# Altium project PCB_Project_Source_IoT.PrjPcb (part 2 of 3)

## Sheet Sheet4_Carregador_Bateria.SchDoc
size A4; SheetNumber: 4; SheetTotal: 6
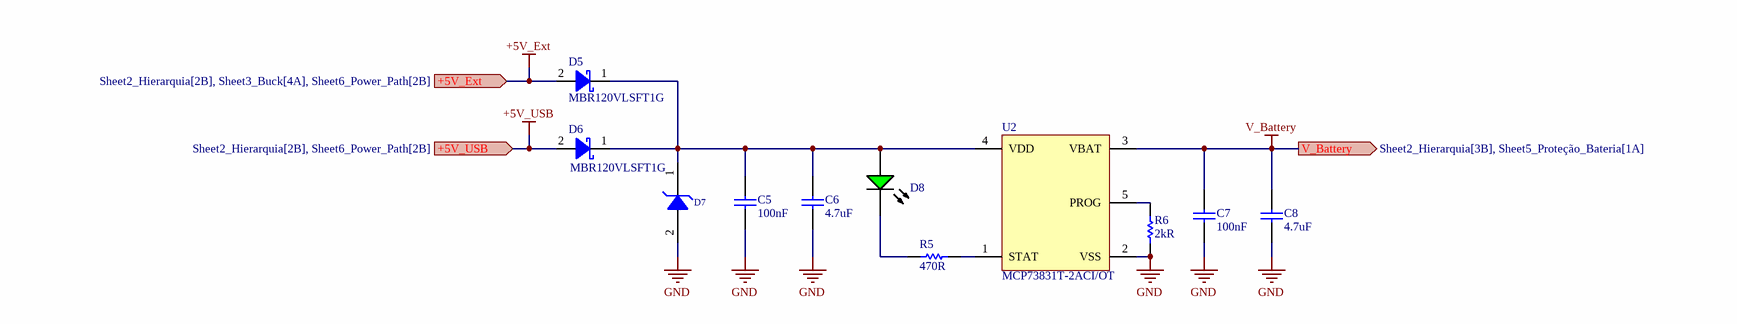
[diagram p3: Sheet4_Carregador_Bateria.SchDoc]

### Parts
(Parts that share a designator on the sheet are numbered #1, #2 ... from top to bottom, then left to right.)
?#2  (no value)  (graphical)
C5  value 100nF  [C-0805]  (hidden comment: CL21B104KACNNNC)
C6  value 4.7uF  [C-0805]  (hidden comment: C2012X5R1E475K125AB)
C7  value 100nF  [C-0805]  (hidden comment: CL21B104KACNNNC)
C8  value 4.7uF  [C-0805]  (hidden comment: C2012X5R1E475K125AB)
D5  MBR120VLSFT1G  [SOD-123F]
D6  MBR120VLSFT1G  [SOD-123F]
D7  SMAJ5.0A-13-F  [DO-214AC]  (value not drawn)
D8  LTST-C170GKT  [0805-LED-G]  (value not drawn)
R5  value 470R  [R-0805]  (hidden comment: CRGCQ0805J470R)
R6  value 2kR  [R-0805]  (hidden comment: ERJ-6ENF2001V)
U2  MCP73831T-2ACI/OT  [TSOT-23-5_A]

### Ports
+5V_Ext (in, see Sheet2_Hierarquia[2B], Sheet3_Buck[4A], Sheet6_Power_Path[2B]), +5V_USB (in, see Sheet2_Hierarquia[2B], Sheet6_Power_Path[2B]), V_Battery (out, see Sheet2_Hierarquia[3B], Sheet5_Proteção_Bateria[1A])

### Nets
+5V_Ext: D5.2(A) ; port +5V_Ext
+5V_USB: D6.2(A) ; port +5V_USB
GND: C5.2 C6.2 C7.2 C8.2 D7.2(A) R6.1 U2.2(VSS)
V_Battery: C7.1 C8.1 U2.3(VBAT) ; port V_Battery
NetC5_1: C5.1 C6.1 D5.1(K) D6.1(K) D7.1(K) D8.2(A) U2.4(VDD)
NetD8_1: D8.1(K) R5.1
NetR5_2: R5.2 U2.1(STAT)
NetR6_2: R6.2 U2.5(PROG)

### Notes on the sheet
- Título:
- Endereço
- Rua Aprígio Veloso, 1500 - Bodocongó
  CEP: 58.429-140
  Campina Grande - Paraíba
  Brasil
- Projeto:
- Conta:
- Projetista:
- Arquivo:
- Data:
- Revisor:
- Rev.:
- Pág.:
- de

### Library data of the parts
?#2 = Title Block
C5 C7 = CL21B104KACNNNC: CAP CER 0.1UF 25V X7R 0805; Manufacturer: Samsung; Material: Ceramic; Tolerance: 10%; Supplier: Digikey; Supplier Part Number: 1276-1099-6-ND; Manufacturer Part Number: CL21B104KACNNNC; RoHS: Yes; Category: Ceramic Capacitors; Stock: 257719; Pricing: 1=0,1, 10=0,031, 50=0,0208, 100=0,0178, 500=0,01262, 1000=0,01102 (USD); Mounting Technology: Surface Mount; Case/Package: 0805; Case Code (Metric): 2012; Case Code (Imperial): 0805; Min Operating Temperature: -55°C; Max Operating Temperature: 125°C; Package Quantity: 1; Packaging: Tape and Reel; Voltage Rating: 25V; Dielectric: X7R; Voltage: 25V; Series: CL; Construction: Flat; Length: 2mm; Width: 0.049inch; Height: 0.85mm; Thickness: 0.037inch; Depth: 1.25mm; Radiation Hardening: No; RoHS Compliant: Yes; ComponentLink1URL: https://datasheet.ciiva.com/25801/cl21b104kacnnnc-25801824.pdf?src-supplier=Digikey; ComponentLink1Description: https://datasheet.ciiva.com/25801/cl21b104kacnnnc-25801824.pdf?src-supplier=Digikey; ComponentLink2URL: https://datasheet.ciiva.com/15216/getdatasheetpartid-355204-15216236.pdf?src-supplier=Verical; ComponentLink2Description: https://datasheet.ciiva.com/15216/getdatasheetpartid-355204-15216236.pdf?src-supplier=Verical; Supplier 1: Digikey; Supplier Part Number 1: 1276-1099-1-ND; Supplier 2: Mouser; Supplier Part Number 2: 187-CL21B104KACNNNC; Voltage Rating (DC): 25V
C6 C8 = C2012X5R1E475K125AB: CAP CER 4.7UF 25V X5R 0805; Manufacturer: TDK; Dielectric Material: Ceramic; Tolerance: 10%; Supplier: Digikey; Supplier Part Number: 445-4116-1-ND; Manufacturer Part Number: C2012X5R1E475K125AB; RoHS: Yes; Category: Ceramic Capacitors; Stock: 2075676; Pricing: 1=0,27, 10=0,158, 50=0,1126, 100=0,0984, 500=0,07452, 1000=0,06706 (USD); Mounting Technology: Surface Mount; Case/Package: 0805; Pins: 2; Case Code (Imperial): 0805; Case Code (Metric): 2012; Weight: 0.000194oz; Material: Ceramic; Min Operating Temperature: -55°C; Max Operating Temperature: 85°C; Voltage Rating: 25V; Voltage Rating (DC): 25V; Packaging: Tape and Reel; Package Quantity: 2000; Dielectric: X5R; Termination: SMD/SMT; Voltage: 25V; Series: C; Construction: Flat; Length: 2mm; Width: 1.25mm; Height: 1.25mm; Depth: 1.25mm; Reach SVHC Compliant: No; Lead Free: Lead Free; RoHS Compliant: Yes; ComponentLink1URL: https://datasheet.ciiva.com/24216/tdkmlcccaprange-24216480.pdf?src-supplier=Mouser; ComponentLink1Description: https://datasheet.ciiva.com/24216/tdkmlcccaprange-24216480.pdf?src-supplier=Mouser; ComponentLink2URL: https://datasheet.ciiva.com/11788/0900766b80c1bb00-11788107.pdf?src-supplier=Rs; ComponentLink2Description: https://datasheet.ciiva.com/11788/0900766b80c1bb00-11788107.pdf?src-supplier=Rs; ComponentLink3URL: https://datasheet.ciiva.com/6251/tdkmlcccaprange-6251817.pdf?src-supplier=Digikey; ComponentLink3Description: https://datasheet.ciiva.com/6251/tdkmlcccaprange-6251817.pdf?src-supplier=Digikey; ComponentLink4URL: https://datasheet.ciiva.com/6251/tdkmlcccaprange-6251820.pdf?src-supplier=Digikey; ComponentLink4Description: https://datasheet.ciiva.com/6251/tdkmlcccaprange-6251820.pdf?src-supplier=Digikey; ComponentLink5URL: https://datasheet.ciiva.com/6251/tdkmlcccaprange-6251823.pdf?src-supplier=Digikey; ComponentLink5Description: https://datasheet.ciiva.com/6251/tdkmlcccaprange-6251823.pdf?src-supplier=Digikey; ComponentLink6URL: https://datasheet.ciiva.com/28602/1744655-28602173.pdf?src-supplier=Element14; ComponentLink6Description: https://datasheet.ciiva.com/28602/1744655-28602173.pdf?src-supplier=Element14; ComponentLink7URL: https://datasheet.ciiva.com/36857/1796654-36857301.pdf?src-supplier=Element14; ComponentLink7Description: https://datasheet.ciiva.com/36857/1796654-36857301.pdf?src-supplier=Element14; ComponentLink8URL: https://datasheet.ciiva.com/16449/e412-c-16449599.pdf?src-supplier=Future+Electronics; ComponentLink8Description: https://datasheet.ciiva.com/16449/e412-c-16449599.pdf?src-supplier=Future+Electronics; Supplier 1: Mouser; Supplier Part Number 1: 810-C2012X5R1E475K; Supplier 2: Digikey; Supplier Part Number 2: 445-4116-1-ND
D5 D6 = MBR120VLSFT1G: DIODE SCHOTTKY 20V 1A SOD123FL; Manufacturer: ON Semiconductor; Max Surge Current: 45A; Forward Voltage: 340mV; Max Reverse Current: 600uA; Element Configuration: Single; Polarity: Standard; Supplier: Digikey; Supplier Part Number: MBR120VLSFT1GOSCT-ND; Manufacturer Part Number: MBR120VLSFT1G; RoHS: Yes; Category: Schottky Diodes; Stock: 20847; Pricing: 1=0,56, 10=0,348, 100=0,2217, 500=0,16708, 1000=0,14944 (USD); Pins: 2; Min Operating Temperature: -65°C; Max Operating Temperature: 125°C; Package Quantity: 3000; Forward Current: 1A; Packaging: Tape and Reel; Max Reverse Leakage Current: 600uA; Average Rectified Current: 1A; Max Repetitive Reverse Voltage (Vrrm): 20V; Max Forward Surge Current (Ifsm): 45A; Peak Non-Repetitive Surge Current: 45A; Voltage Rating (DC): 20V; Current Rating: 1A; Output Current: 1A; Max Reverse Voltage (DC): 20V; Series: -; Length: 0.114inch; Width: 0.071inch; Height: 0.035inch; Radiation Hardening: No; Reach SVHC Compliant: No; Lead Free: Lead Free; Halogen Free: Halogen Free; RoHS Compliant: Yes; ComponentLink1URL: https://datasheet.ciiva.com/7962/85900-7962720.pdf?src-supplier=Element14; ComponentLink1Description: https://datasheet.ciiva.com/7962/85900-7962720.pdf?src-supplier=Element14; ComponentLink2URL: https://datasheet.ciiva.com/915/mbr120vlsft1-d-915659.pdf?src-supplier=Digikey; ComponentLink2Description: https://datasheet.ciiva.com/915/mbr120vlsft1-d-915659.pdf?src-supplier=Digikey; ComponentLink3URL: https://datasheet.ciiva.com/915/mbr120vlsft1-d-915660.pdf?src-supplier=Digikey; ComponentLink3Description: https://datasheet.ciiva.com/915/mbr120vlsft1-d-915660.pdf?src-supplier=Digikey; ComponentLink4URL: https://datasheet.ciiva.com/18435/70100467-18435526.pdf?src-supplier=Allied+Electronics; ComponentLink4Description: https://datasheet.ciiva.com/18435/70100467-18435526.pdf?src-supplier=Allied+Electronics; ComponentLink5URL: https://datasheet.ciiva.com/16392/mbr120vlsft1-d-16392906.pdf?src-supplier=Future+Electronics; ComponentLink5Description: https://datasheet.ciiva.com/16392/mbr120vlsft1-d-16392906.pdf?src-supplier=Future+Electronics; Supplier 1: Digikey; Supplier Part Number 1: MBR120VLSFT1GOSCT-ND; Supplier 2: Mouser; Supplier Part Number 2: 863-MBR120VLSFT1G
D7 = SMAJ5.0A-13-F: TVS DIODE 5VWM 9.2VC SMA; Manufacturer: Diodes; Working Voltage: 5V; Clamping Voltage: 9.2V; Peak Pulse Power: 400W; Breakdown Voltage: 6.4V; Peak Pulse Current: 43.5A; Number of Elements: 1; Max Surge Current: 40A; Polarity: Unidirectional; Test Current: 10mA; Leakage Current: 800uA; Power Line Protection: No; Diode Type: ZENER; Max Breakdown Voltage: 7.25V; Element Configuration: Single; Capacitance: 2nF; Forward Voltage: 3.5V; Manufacturer Part Number: SMAJ5.0A-13-F; RoHS: Yes; Category: TVS Diodes; Stock 1: 435542; Pricing 1: 1=0,42000, 10=0,31700, 100=0,19770, 500=0,13528, 1000=0,10406, 2000=0,09366 (USD); Mount: Surface Mount; Case/Package: SMA; Number of Pins: 2; Contact Plating: Tin,Matte; Min Operating Temperature: -55°C; Max Operating Temperature: 150°C; Package Quantity: 5000; Termination: SMD/SMT; Series: -; Packaging: Tape and Reel; Reverse Standoff Voltage: 5V; Max Power Dissipation: 400W; Reverse Breakdown Voltage: 6.4V; Voltage Rating (DC): 5V; Min Breakdown Voltage: 6.4V; Resistor Type: Zener; Number of Unidirectional Channels: 1; Direction: Unidirectional; Max Reverse Leakage Current: 800uA; Power Dissipation: 400W; Clamping Voltage-Max: 9.2V; Max Output Current: 43.5A; ESD Protection: No; Length: 4.6mm; Width: 2.92mm; Height: 2.1mm; Radiation Hardening: No; RoHS Compliant: Yes; Lead Free: Lead Free; REACH SVHC: No SVHC; ComponentLink1URL: https://datasheet.ciiva.com/27052/1542127-27052431.pdf?src-supplier=Jameco; ComponentLink1Description: https://datasheet.ciiva.com/27052/1542127-27052431.pdf?src-supplier=Jameco; ComponentLink2URL: https://datasheet.ciiva.com/22696/1670961-22696859.pdf?src-supplier=Element14; ComponentLink2Description: https://datasheet.ciiva.com/22696/1670961-22696859.pdf?src-supplier=Element14; ComponentLink3URL: https://datasheet.ciiva.com/26933/getdatasheetpartid-35116-26933158.pdf?src-supplier=Verical; ComponentLink3Description: https://datasheet.ciiva.com/26933/getdatasheetpartid-35116-26933158.pdf?src-supplier=Verical; Supplier 1: Digi-Key; Supplier 2: Mouser; Supplier 3: Arrow Electronics; Supplier 4: Digi-Key; Supplier 5: Mouser; Supplier 6: Digi-Key; Supplier 7: Mouser; Supplier Part Number 7: 863-SZ1SMA5.0AT3G; Supplier Part Number 6: F11528CT-ND; Supplier Part Number 5: 625-SMAJ5.0A-E3; Supplier Part Number 4: SMAJ5.0A-E3/61GICT-ND; Supplier Part Number 3: SMAJ5.0A-13-F; Supplier Part Number 2: 621-SMAJ5.0A-13-F; Supplier Part Number 1: SMAJ5.0A-FDICT-ND; JLCPCB Part: C87074
D8 = LTST-C170GKT: LED GREEN CLEAR SMD; Manufacturer: Vishay Lite-On; Lens Color: Colorless; Luminous Intensity: 6mcd; Forward Voltage: 2.1V; Test Current: 10mA; Wavelength: 565nm; Viewing Angle: 130°; Dominant Wavelength: 569nm; Lens Style: Diffused,Colorless,Rectangular; Forward Current: 30mA; Number of LEDs: 1; Power Dissipation: 100mW; Reverse Voltage: 5V; Supplier 1: Digi-Key; Manufacturer Part Number: LTST-C170GKT; RoHS: Yes; Category: LEDs; Stock 1: 753504; Pricing 1: 1=0,30000, 10=0,16000, 100=0,07440, 500=0,06870, 1000=0,05382 (USD); Mount: Surface Mount; Case/Package: 0805; Number of Pins: 2; Color: Green; Case Code (Metric): 2012; Case Code (Imperial): 0805; Min Operating Temperature: -55°C; Max Operating Temperature: 85°C; Package Quantity: 1; Packaging: Tape and Reel; Series: CHIPLED 0805; Lens Transparency: Clear; Illumination Color: Green; Number of Elements: 1; Power Rating: 100mW; Voltage: 5V; Length: 2mm; Width: 1.25mm; Height: 1.1mm; Depth: 1.25mm; Radiation Hardening: No; RoHS Compliant: Yes; Lead Free: Lead Free; ComponentLink1URL: https://datasheet.ciiva.com/2110/ltst-c170gkt-2110128.pdf?src-supplier=Digi-Key; ComponentLink1Description: https://datasheet.ciiva.com/2110/ltst-c170gkt-2110128.pdf?src-supplier=Digi-Key; ComponentLink2URL: https://datasheet.ciiva.com/11773/0900766b80dc0278-11773630.pdf?src-supplier=RSComponents; ComponentLink2Description: https://datasheet.ciiva.com/11773/0900766b80dc0278-11773630.pdf?src-supplier=RSComponents; ComponentLink3URL: https://datasheet.ciiva.com/12400/lite-on-ltst-c170gkt-187191-12400783.pdf?src-supplier=Mouser; ComponentLink3Description: https://datasheet.ciiva.com/12400/lite-on-ltst-c170gkt-187191-12400783.pdf?src-supplier=Mouser; ComponentLink4URL: https://datasheet.ciiva.com/15117/getdatasheetpartid-142079-15117738.pdf?src-supplier=Verical; ComponentLink4Description: https://datasheet.ciiva.com/15117/getdatasheetpartid-142079-15117738.pdf?src-supplier=Verical; ComponentLink5URL: https://datasheet.ciiva.com/25772/ltst-c170gkt-25772881.pdf?src-supplier=Allied+Electronics; ComponentLink5Description: https://datasheet.ciiva.com/25772/ltst-c170gkt-25772881.pdf?src-supplier=Allied+Electronics; ComponentLink6URL: https://datasheet.ciiva.com/16387/ltst-c170gkt-16387357.pdf?src-supplier=Future+Electronics; ComponentLink6Description: https://datasheet.ciiva.com/16387/ltst-c170gkt-16387357.pdf?src-supplier=Future+Electronics; Supplier 2: Mouser; Supplier Part Number 2: 859-LTST-C170GKT; Supplier Part Number 1: 160-1179-1-ND; JLCPCB Part: C125090
R5 = CRGCQ0805J470R: RES 470 OHM 5% 1/8W 0805; Manufacturer: TE Connectivity; Max Power Dissipation: 125mW; Temperature Coefficient: 100ppm/°C; Operating Supply Voltage: 150V; Supplier: Digikey; Supplier Part Number: A130132CT-ND; Manufacturer Part Number: CRGCQ0805J470R; RoHS: Yes; Category: Chip SMD Resistors; Stock: 837845; Pricing: 1=0,1, 10=0,026, 50=0,0162, 100=0,0137, 500=0,00942, 1000=0,00813 (USD); Case/Package: 0805; Case Code (Imperial): 0805; Case Code (Metric): 2012; Min Operating Temperature: -55°C; Max Operating Temperature: 155°C; Features: Moisture Resistant,Automotive AEC-Q200; Series: CRGCQ; Packaging: Cut Tape; Tolerance: 5%; Number of Terminations: 2; Power Rating: 125mW; Voltage Rating: 150V; Voltage Rating (DC): 150V; Height: 650um; Ratings: AEC-Q200; RoHS Compliant: Yes; ComponentLink1URL: http://datasheet.octopart.com/CRGCQ0805J470R-TE-Connectivity-datasheet-114679081.pdf?src-supplier=Digikey; ComponentLink1Description: http://datasheet.octopart.com/CRGCQ0805J470R-TE-Connectivity-datasheet-114679081.pdf?src-supplier=Digikey; ComponentLink2URL: http://datasheet.octopart.com/CRGCQ0805J470R-TE-Connectivity-datasheet-114679081.pdf?src-supplier=Farnell; ComponentLink2Description: http://datasheet.octopart.com/CRGCQ0805J470R-TE-Connectivity-datasheet-114679081.pdf?src-supplier=Farnell; ComponentLink3URL: http://datasheet.octopart.com/CRGCQ0805J470R-TE-Connectivity-datasheet-114679081.pdf?src-supplier=Avnet; ComponentLink3Description: http://datasheet.octopart.com/CRGCQ0805J470R-TE-Connectivity-datasheet-114679081.pdf?src-supplier=Avnet; ComponentLink4URL: http://datasheet.octopart.com/CRGCQ0805J470R-TE-Connectivity-datasheet-114679081.pdf?src-supplier=Mouser; ComponentLink4Description: http://datasheet.octopart.com/CRGCQ0805J470R-TE-Connectivity-datasheet-114679081.pdf?src-supplier=Mouser; ComponentLink5URL: http://datasheet.octopart.com/CRGCQ0805J470R-TE-Connectivity-datasheet-114679081.pdf?src-supplier=Newark; ComponentLink5Description: http://datasheet.octopart.com/CRGCQ0805J470R-TE-Connectivity-datasheet-114679081.pdf?src-supplier=Newark; ComponentLink6URL: http://datasheet.octopart.com/CRGCQ0805J470R-TE-Connectivity-datasheet-114679081.pdf?src-supplier=Onlinecomponents.com; ComponentLink6Description: http://datasheet.octopart.com/CRGCQ0805J470R-TE-Connectivity-datasheet-114679081.pdf?src-supplier=Onlinecomponents.com; ComponentLink7URL: https://datasheet.octopart.com/CRGCQ0805J470R-TE-Connectivity-datasheet-114679081.pdf?src-supplier=Master+Electronics; ComponentLink7Description: https://datasheet.octopart.com/CRGCQ0805J470R-TE-Connectivity-datasheet-114679081.pdf?src-supplier=Master+Electronics; ComponentLink8URL: http://datasheet.octopart.com/CRGCQ0805J470R-TE-Connectivity-datasheet-114679081.pdf?src-supplier=Heilind+Electronics; ComponentLink8Description: http://datasheet.octopart.com/CRGCQ0805J470R-TE-Connectivity-datasheet-114679081.pdf?src-supplier=Heilind+Electronics; ComponentLink9URL: http://datasheet.octopart.com/CRGCQ0805J470R-TE-Connectivity-datasheet-114679081.pdf?src-supplier=Sager+Electronics; ComponentLink9Description: http://datasheet.octopart.com/CRGCQ0805J470R-TE-Connectivity-datasheet-114679081.pdf?src-supplier=Sager+Electronics; ComponentLink10URL: http://datasheet.octopart.com/CRGCQ0805J470R-TE-Connectivity-datasheet-114679081.pdf?src-supplier=Interstate+Connecting+Components; ComponentLink10Description: http://datasheet.octopart.com/CRGCQ0805J470R-TE-Connectivity-datasheet-114679081.pdf?src-supplier=Interstate+Connecting+Components; ComponentLink11URL: http://datasheet.octopart.com/CRGCQ0805J470R-TE-Connectivity-datasheet-114679081.pdf?src-supplier=Electro+Sonic; ComponentLink11Description: http://datasheet.octopart.com/CRGCQ0805J470R-TE-Connectivity-datasheet-114679081.pdf?src-supplier=Electro+Sonic; Supplier 1: Mouser; Supplier Part Number 1: 279-CRGCQ0805J470R; Supplier 2: Digikey; Supplier Part Number 2: A130132CT-ND
R6 = ERJ-6ENF2001V: RES SMD 2K OHM 1% 1/8W 0805; Manufacturer: Panasonic; Power Rating: 125mW; Voltage Rating: 150V; Temperature Coefficient: 100ppm/°C; Supplier: Digikey; Supplier Part Number: P2.00KCCT-ND; Manufacturer Part Number: ERJ-6ENF2001V; RoHS: Yes; Category: Chip SMD Resistors; Stock: 369929; Pricing: 1=0,11, 10=0,053, 50=0,0344, 100=0,0292, 500=0,02058, 1000=0,01792 (USD); Mounting Technology: Surface Mount; Case/Package: 0805; Case Code (Metric): 2012; Case Code (Imperial): 0805; Contact Plating: Tin; Weight: 0.000194oz; Min Operating Temperature: -55°C; Max Operating Temperature: 155°C; Packaging: Tape and Reel; Tolerance: 1%; Package Quantity: 1; Resistor Type: Thick Film; Number of Terminations: 2; Termination: SMD/SMT; Max Power Dissipation: 125mW; Voltage Rating (DC): 150V; Features: Automotive AEC-Q200; Series: ERJ; Resistance Tolerance: 1%; Construction: Rectangular; Technology: THICK FILM; Length: 2mm; Width: 1.2mm; Height: 0.6mm; Depth: 1.25mm; Radiation Hardening: No; Reach SVHC Compliant: No; Military Standard: Not; Lead Free: Lead Free; RoHS Compliant: Yes; Supplier 1: Mouser; Supplier Part Number 1: 667-ERJ-6ENF2001V; Supplier 2: Digikey; Supplier Part Number 2: P2.00KCCT-ND; Supplier 3: Digikey; Supplier Part Number 3: P2.00KCCT-ND
U2 = MCP73831T-2ACI/OT: IC BATT CNTL LI-ION 1CEL SOT23-5; Manufacturer: Microchip; Number of Cells: 1; Max Supply Voltage: 6V; Output Voltage: 4.2V; Min Supply Voltage: 3.75V; Output Current: 500mA; Max Output Voltage: 4.5V; Max Power Dissipation: 1.54W; Drain to Source Resistance: 350mR; Min Output Voltage: 4.168V; Voltage Rating: 4.534V; Fault Protection: Over Voltage; Supplier: Digikey; Supplier Part Number: MCP73831T-2ACI/OTCT-ND; Manufacturer Part Number: MCP73831T-2ACI/OT; RoHS: Yes; Category: Battery Management; Stock: 95605; Pricing: 1=0,76, 25=0,63, 100=0,6125 (USD); Mounting Technology: Surface Mount; Case/Package: SOT-23; Pins: 5; Weight: 0.00709oz; Min Operating Temperature: -40°C; Max Operating Temperature: 85°C; Number of Outputs: 1; Packaging: Tape and Reel; Number of Channels: 1; Termination: SMD/SMT; Max Charge Current: 500mA; Series: -; Battery Pack Voltage: 4.2V; Length: 3.1mm; Width: 1.8mm; Height: 1.3mm; Radiation Hardening: No; RoHS Compliant: Yes; Reach SVHC Compliant: No; Lead Free: Lead Free; ComponentLink1URL: https://datasheet.ciiva.com/22828/0900766b80d2b53a-22828876.pdf?src-supplier=Rs; ComponentLink1Description: https://datasheet.ciiva.com/22828/0900766b80d2b53a-22828876.pdf?src-supplier=Rs; ComponentLink2URL: https://datasheet.ciiva.com/26344/651521-da-01-en-contr-mcp73831t-2aci-ot-sot-23-5-mcp-26344458.pdf?src-supplier=Conrad; ComponentLink2Description: https://datasheet.ciiva.com/26344/651521-da-01-en-contr-mcp73831t-2aci-ot-sot-23-5-mcp-26344458.pdf?src-supplier=Conrad; ComponentLink3URL: https://datasheet.ciiva.com/1931/21984e-1931953.pdf?src-supplier=Digikey; ComponentLink3Description: https://datasheet.ciiva.com/1931/21984e-1931953.pdf?src-supplier=Digikey; ComponentLink4URL: https://datasheet.ciiva.com/1931/21984e-1931954.pdf?src-supplier=Digikey; ComponentLink4Description: https://datasheet.ciiva.com/1931/21984e-1931954.pdf?src-supplier=Digikey; ComponentLink5URL: https://datasheet.ciiva.com/1931/21984e-1931955.pdf?src-supplier=Digikey; ComponentLink5Description: https://datasheet.ciiva.com/1931/21984e-1931955.pdf?src-supplier=Digikey; ComponentLink6URL: https://datasheet.ciiva.com/3213/21984e-3213404.pdf?src-supplier=Avnet; ComponentLink6Description: https://datasheet.ciiva.com/3213/21984e-3213404.pdf?src-supplier=Avnet; ComponentLink7URL: https://datasheet.ciiva.com/28626/630369-28626439.pdf?src-supplier=Element14; ComponentLink7Description: https://datasheet.ciiva.com/28626/630369-28626439.pdf?src-supplier=Element14; ComponentLink8URL: https://datasheet.ciiva.com/46385/630369-46385324.pdf?src-supplier=Element14; ComponentLink8Description: https://datasheet.ciiva.com/46385/630369-46385324.pdf?src-supplier=Element14; ComponentLink9URL: https://datasheet.ciiva.com/1137/630369-1137803.pdf?src-supplier=Element14; ComponentLink9Description: https://datasheet.ciiva.com/1137/630369-1137803.pdf?src-supplier=Element14; ComponentLink10URL: https://datasheet.ciiva.com/1144/630369-1144461.pdf?src-supplier=Newark; ComponentLink10Description: https://datasheet.ciiva.com/1144/630369-1144461.pdf?src-supplier=Newark; ComponentLink11URL: https://datasheet.ciiva.com/16286/filehandler-aspxddocname-en025112-16286957.pdf?src-supplier=Future+Electronics; ComponentLink11Description: https://datasheet.ciiva.com/16286/filehandler-aspxddocname-en025112-16286957.pdf?src-supplier=Future+Electronics; Supplier 1: Digikey; Supplier Part Number 1: MCP73831T-2ACI/OTCT-ND; Supplier 2: Mouser; Supplier Part Number 2: 579-MCP73831T-2ACIOT

## Sheet Sheet5_Proteção_Bateria.SchDoc
size A4; SheetNumber: 5; SheetTotal: 6
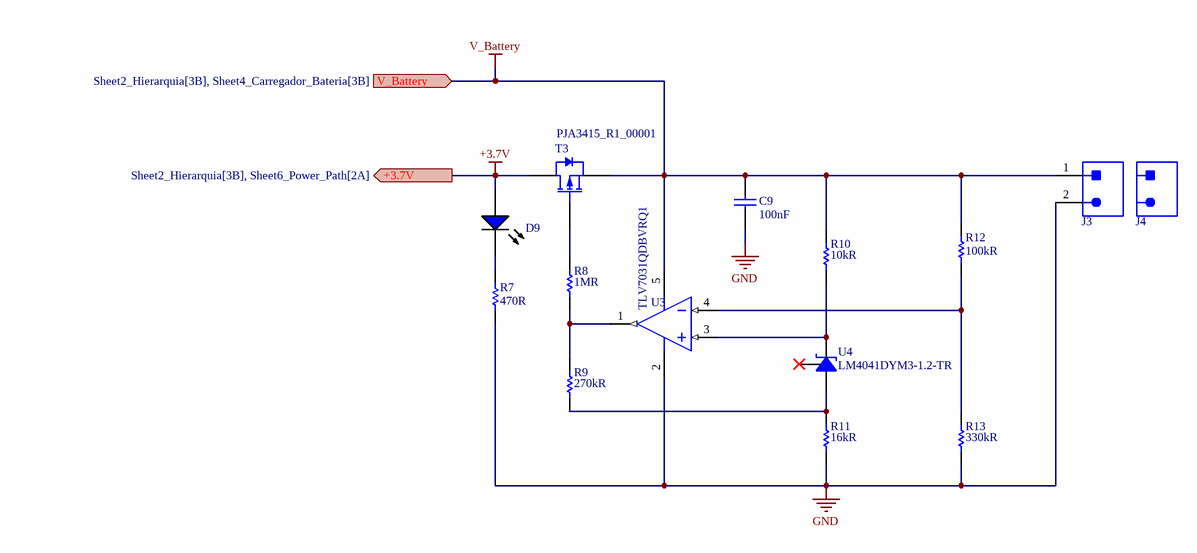
[diagram p4: Sheet5_Proteção_Bateria.SchDoc]

### Parts
(Parts that share a designator on the sheet are numbered #1, #2 ... from top to bottom, then left to right.)
?#3  (no value)  (graphical)
C9  value 100nF  [C-0805]  (hidden comment: CL21B104KACNNNC)
D9  LTST-C171TBKT  [0805-LED-B]  (value not drawn)
J3  5444262  [5444262]  (value not drawn)
J4  5447861  [5447861]  (value not drawn)
R7  value 470R  [R-0805]  (hidden comment: CRGCQ0805J470R)
R8  value 1MR  [R-0805]  (hidden comment: RC0805FR-071ML)
R9  value 270kR  [R-0805]  (hidden comment: RC0805FR-07270KL)
R10  value 10kR  [R-0805]  (hidden comment: RC0805FR-0710KL)
R11  value 16kR  [R-0805]  (hidden comment: RC0805FR-0716KL)
R12  value 100kR  [R-0805]  (hidden comment: CRGCQ0805F100K)
R13  value 330kR  [R-0805]  (hidden comment: RC0805FR-13330KL)
T3  PJA3415_R1_00001  [SOT23-3]
U3  TLV7031QDBVRQ1  [SOT-753]
U4  LM4041DYM3-1.2-TR  [SOT23-3]

### Ports
+3.7V (out, see Sheet2_Hierarquia[3B], Sheet6_Power_Path[2A]), V_Battery (in, see Sheet2_Hierarquia[3B], Sheet4_Carregador_Bateria[3B])

### Nets
+3.7V: D9.2(A) T3.3(D) ; port +3.7V
GND: C9.2 J3.2 R7.1 R11.1 R13.1 U3.2(VEE)
V_Battery: C9.1 J3.1 R10.2 R12.2 T3.2(S) U3.5(VCC) ; port V_Battery
NetD9_1: D9.1(K) R7.2
NetR8_1: R8.1 R9.2 U3.1(OUT)
NetR8_2: R8.2 T3.1(G)
NetR9_1: R9.1 R11.2 U4.2(A)
NetR10_1: R10.1 U3.3(IN+) U4.1(K)
NetR12_1: R12.1 R13.2 U3.4(IN-)

Not connected (* = marked no-connect by the designer): U4 3(NC)*

### Notes on the sheet
- Título:
- Endereço
- Rua Aprígio Veloso, 1500 - Bodocongó
  CEP: 58.429-140
  Campina Grande - Paraíba
  Brasil
- Projeto:
- Conta:
- Projetista:
- Arquivo:
- Data:
- Revisor:
- Rev.:
- Pág.:
- de

### Library data of the parts
?#3 = Title Block
C9 = CL21B104KACNNNC: as C5 on sheet Sheet4_Carregador_Bateria; Supplier: Digikey; Supplier Part Number: 1276-1099-6-ND; Manufacturer Part Number: CL21B104KACNNNC; RoHS: Yes; Category: Ceramic Capacitors; Stock: 257719; Pricing: 1=0,1, 10=0,031, 50=0,0208, 100=0,0178, 500=0,01262, 1000=0,01102 (USD); Mounting Technology: Surface Mount; Case/Package: 0805; Case Code (Metric): 2012; Case Code (Imperial): 0805; Min Operating Temperature: -55°C; Max Operating Temperature: 125°C; Package Quantity: 1; Packaging: Tape and Reel; Voltage Rating: 25V; Dielectric: X7R; Voltage: 25V; Series: CL; Construction: Flat; Length: 2mm; Width: 0.049inch; Height: 0.85mm; Thickness: 0.037inch; Depth: 1.25mm; Radiation Hardening: No; RoHS Compliant: Yes; ComponentLink1URL: https://datasheet.ciiva.com/25801/cl21b104kacnnnc-25801824.pdf?src-supplier=Digikey; ComponentLink1Description: https://datasheet.ciiva.com/25801/cl21b104kacnnnc-25801824.pdf?src-supplier=Digikey; ComponentLink2URL: https://datasheet.ciiva.com/15216/getdatasheetpartid-355204-15216236.pdf?src-supplier=Verical; ComponentLink2Description: https://datasheet.ciiva.com/15216/getdatasheetpartid-355204-15216236.pdf?src-supplier=Verical; Supplier 1: Digikey; Supplier Part Number 1: 1276-1099-1-ND; Supplier 2: Mouser; Supplier Part Number 2: 187-CL21B104KACNNNC; Voltage Rating (DC): 25V
D9 = LTST-C171TBKT: LED BLUE CLEAR CHIP SMD; Manufacturer: Vishay Lite-On; Lens Color: Colorless; Forward Current: 20mA; Forward Voltage: 3.8V; Luminous Intensity: 180mcd; Viewing Angle: 130°; Lens Style: Diffused,Colorless,Rectangular,Clear; Dominant Wavelength: 475nm; Wavelength: 468nm; Number of LEDs: 1; Power Dissipation: 76mW; Reverse Voltage: 5V; Manufacturer Part Number: LTST-C171TBKT; RoHS: Yes; Category: LEDs; Stock 1: 433320; Pricing 1: 1=0,32000, 10=0,25100, 100=0,11280, 500=0,10192, 1000=0,08372 (USD); Mount: Surface Mount; Case/Package: 0805; Number of Pins: 2; Color: Blue; Case Code (Metric): 2012; Case Code (Imperial): 0805; Min Operating Temperature: -20°C; Max Operating Temperature: 80°C; Illumination Color: Blue; Packaging: Tape and Reel; Package Quantity: 1; Test Current: 20mA; Lens Transparency: Clear; Series: CHIPLED 0805; Number of Elements: 1; Length: 2mm; Width: 1.25mm; Height: 0.8mm; Depth: 1.25mm; Radiation Hardening: No; Lead Free: Lead Free; RoHS Compliant: Yes; ComponentLink1URL: https://datasheet.ciiva.com/2110/ltst-c171tbkt-2110304.pdf?src-supplier=Digi-Key; ComponentLink1Description: https://datasheet.ciiva.com/2110/ltst-c171tbkt-2110304.pdf?src-supplier=Digi-Key; ComponentLink2URL: https://datasheet.ciiva.com/11774/0900766b80dc029b-11774836.pdf?src-supplier=RSComponents; ComponentLink2Description: https://datasheet.ciiva.com/11774/0900766b80dc029b-11774836.pdf?src-supplier=RSComponents; ComponentLink3URL: https://datasheet.ciiva.com/12403/lite-on-ltst-c171tbkt-187246-12403800.pdf?src-supplier=Mouser; ComponentLink3Description: https://datasheet.ciiva.com/12403/lite-on-ltst-c171tbkt-187246-12403800.pdf?src-supplier=Mouser; ComponentLink4URL: https://datasheet.ciiva.com/15118/getdatasheetpartid-225754-15118121.pdf?src-supplier=Verical; ComponentLink4Description: https://datasheet.ciiva.com/15118/getdatasheetpartid-225754-15118121.pdf?src-supplier=Verical; ComponentLink5URL: https://datasheet.ciiva.com/2110/s-110-ltst-c171tbkt0630-2110305.pdf?src-supplier=Digi-Key; ComponentLink5Description: https://datasheet.ciiva.com/2110/s-110-ltst-c171tbkt0630-2110305.pdf?src-supplier=Digi-Key; ComponentLink6URL: https://datasheet.ciiva.com/16444/lite-onltst-c171tbkt-16444780.pdf?src-supplier=Future+Electronics; ComponentLink6Description: https://datasheet.ciiva.com/16444/lite-onltst-c171tbkt-16444780.pdf?src-supplier=Future+Electronics; JLCPCB Part: C98225; Supplier 1: Digikey; Supplier Part Number 1: 160-1645-1-ND; Supplier 2: Mouser; Supplier Part Number 2: 859-LTST-C171TBKT
J3 = 5444262: TERM BLOCK HDR 2POS 90DEG 3.81MM; Manufacturer: Phoenix Contact; Current Rating: 8A; Voltage Rating: 160V; Number of Positions: 2; Number of Levels: 1; Voltage: 300V; Pitch: 0.15inch; Supplier 1: Digi-Key; Manufacturer Part Number: 5444262; RoHS: Yes; Category: Terminal Blocks; Stock 1: 66186; Pricing 1: 1=0,87000, 10=0,83600, 50=0,81320, 100=0,76000, 250=0,69920, 500=0,64600, 1000=0,61560, 2500=0,60648 (USD); Mount: Through Hole; Contact Plating: Tin; Color: Green; Housing Material: Polyamide; Packaging: Bulk; Termination: Solder; Package Quantity: 100; Number of Positions Per Level: 2; Current: 8A; Length: 9.2mm; RoHS Compliant: Yes; Flammability Rating: UL94 V-0; ComponentLink1URL: https://datasheet.ciiva.com/29682/5444262-29682658.pdf?src-supplier=Digi-Key; ComponentLink1Description: https://datasheet.ciiva.com/29682/5444262-29682658.pdf?src-supplier=Digi-Key; Supplier 2: Mouser; Supplier Part Number 2: 651-5444262; Supplier Part Number 1: 277-11313-ND; JLCPCB Part: *
J4 = 5447861: TERM BLOCK PLUG 2POS STR 3.81MM; Manufacturer: Phoenix Contact; Current Rating: 8A; Voltage Rating: 160V; Number of Positions: 2; Number of Levels: 1; Connector Type: Screw; Voltage: 300V; Wire Gauge (Max): 30AWG; Wire Gauge (Min): 14AWG; Pitch: 0.15inch; Supplier 1: Digi-Key; Manufacturer Part Number: 5447861; RoHS: Yes; Category: Terminal Blocks; Stock 1: 30203; Pricing 1: 1=2,56000, 10=2,45300, 50=2,38620, 100=2,23000, 250=2,05160, 500=1,89550, 1000=1,80631, 2500=1,77954 (USD); Mount: Free Hanging; Number of Pins: 2; Color: Green; Contact Plating: Tin; Housing Material: Polyamide; Package Quantity: 100; Packaging: Bulk; Number of Positions Per Level: 2; Termination: Screw; Current: 8A; Flammability Rating: UL94 V-0; ComponentLink1URL: https://datasheet.ciiva.com/29706/5447861-29706032.pdf?src-supplier=Digi-Key; ComponentLink1Description: https://datasheet.ciiva.com/29706/5447861-29706032.pdf?src-supplier=Digi-Key; Supplier 2: Mouser; Supplier Part Number 1: 277-11343-ND; Supplier Part Number 2: 651-5447861; JLCPCB Part: *
R7 = CRGCQ0805J470R: as R5 on sheet Sheet4_Carregador_Bateria; Supplier: Digikey; Supplier Part Number: A130132CT-ND; Manufacturer Part Number: CRGCQ0805J470R; RoHS: Yes; Category: Chip SMD Resistors; Stock: 837845; Pricing: 1=0,1, 10=0,026, 50=0,0162, 100=0,0137, 500=0,00942, 1000=0,00813 (USD); Case/Package: 0805; Case Code (Imperial): 0805; Case Code (Metric): 2012; Min Operating Temperature: -55°C; Max Operating Temperature: 155°C; Features: Moisture Resistant,Automotive AEC-Q200; Series: CRGCQ; Packaging: Cut Tape; Tolerance: 5%; Number of Terminations: 2; Power Rating: 125mW; Voltage Rating: 150V; Voltage Rating (DC): 150V; Height: 650um; Ratings: AEC-Q200; RoHS Compliant: Yes; ComponentLink1URL: http://datasheet.octopart.com/CRGCQ0805J470R-TE-Connectivity-datasheet-114679081.pdf?src-supplier=Digikey; ComponentLink1Description: http://datasheet.octopart.com/CRGCQ0805J470R-TE-Connectivity-datasheet-114679081.pdf?src-supplier=Digikey; ComponentLink2URL: http://datasheet.octopart.com/CRGCQ0805J470R-TE-Connectivity-datasheet-114679081.pdf?src-supplier=Farnell; ComponentLink2Description: http://datasheet.octopart.com/CRGCQ0805J470R-TE-Connectivity-datasheet-114679081.pdf?src-supplier=Farnell; ComponentLink3URL: http://datasheet.octopart.com/CRGCQ0805J470R-TE-Connectivity-datasheet-114679081.pdf?src-supplier=Avnet; ComponentLink3Description: http://datasheet.octopart.com/CRGCQ0805J470R-TE-Connectivity-datasheet-114679081.pdf?src-supplier=Avnet; ComponentLink4URL: http://datasheet.octopart.com/CRGCQ0805J470R-TE-Connectivity-datasheet-114679081.pdf?src-supplier=Mouser; ComponentLink4Description: http://datasheet.octopart.com/CRGCQ0805J470R-TE-Connectivity-datasheet-114679081.pdf?src-supplier=Mouser; ComponentLink5URL: http://datasheet.octopart.com/CRGCQ0805J470R-TE-Connectivity-datasheet-114679081.pdf?src-supplier=Newark; ComponentLink5Description: http://datasheet.octopart.com/CRGCQ0805J470R-TE-Connectivity-datasheet-114679081.pdf?src-supplier=Newark; ComponentLink6URL: http://datasheet.octopart.com/CRGCQ0805J470R-TE-Connectivity-datasheet-114679081.pdf?src-supplier=Onlinecomponents.com; ComponentLink6Description: http://datasheet.octopart.com/CRGCQ0805J470R-TE-Connectivity-datasheet-114679081.pdf?src-supplier=Onlinecomponents.com; ComponentLink7URL: https://datasheet.octopart.com/CRGCQ0805J470R-TE-Connectivity-datasheet-114679081.pdf?src-supplier=Master+Electronics; ComponentLink7Description: https://datasheet.octopart.com/CRGCQ0805J470R-TE-Connectivity-datasheet-114679081.pdf?src-supplier=Master+Electronics; ComponentLink8URL: http://datasheet.octopart.com/CRGCQ0805J470R-TE-Connectivity-datasheet-114679081.pdf?src-supplier=Heilind+Electronics; ComponentLink8Description: http://datasheet.octopart.com/CRGCQ0805J470R-TE-Connectivity-datasheet-114679081.pdf?src-supplier=Heilind+Electronics; ComponentLink9URL: http://datasheet.octopart.com/CRGCQ0805J470R-TE-Connectivity-datasheet-114679081.pdf?src-supplier=Sager+Electronics; ComponentLink9Description: http://datasheet.octopart.com/CRGCQ0805J470R-TE-Connectivity-datasheet-114679081.pdf?src-supplier=Sager+Electronics; ComponentLink10URL: http://datasheet.octopart.com/CRGCQ0805J470R-TE-Connectivity-datasheet-114679081.pdf?src-supplier=Interstate+Connecting+Components; ComponentLink10Description: http://datasheet.octopart.com/CRGCQ0805J470R-TE-Connectivity-datasheet-114679081.pdf?src-supplier=Interstate+Connecting+Components; ComponentLink11URL: http://datasheet.octopart.com/CRGCQ0805J470R-TE-Connectivity-datasheet-114679081.pdf?src-supplier=Electro+Sonic; ComponentLink11Description: http://datasheet.octopart.com/CRGCQ0805J470R-TE-Connectivity-datasheet-114679081.pdf?src-supplier=Electro+Sonic; Supplier 1: Mouser; Supplier Part Number 1: 279-CRGCQ0805J470R; Supplier 2: Digikey; Supplier Part Number 2: A130132CT-ND
R8 = RC0805FR-071ML: RES 1M OHM 1% 1/8W 0805; Manufacturer: Yageo; Voltage Rating: 150V; Temperature Coefficient: 250ppm/°C; Power Rating: 125mW; Supplier: Digikey; Supplier Part Number: 311-1.00MCRCT-ND; Manufacturer Part Number: RC0805FR-071ML; RoHS: Yes; Category: Chip SMD Resistors; Stock: 145027; Pricing: 1=0,1, 10=0,026, 50=0,0162, 100=0,0134, 500=0,00906, 1000=0,00778 (USD); Case/Package: Molded; Case Code (Metric): 2012; Case Code (Imperial): 0805; Min Operating Temperature: -55°C; Max Operating Temperature: 155°C; Tolerance: 1%; Packaging: Tape and Reel; Resistor Type: Thick Film; Construction: Rectangular; Resistance Tolerance: 1%; Voltage Rating (AC): 150V; Length: 2mm; Depth: 1.25mm; Lead Free: Lead Free; RoHS Compliant: Yes; Reach SVHC Compliant: Unknown; Military Standard: Not; ComponentLink1URL: https://datasheet.ciiva.com/17419/rc0805-17419909.pdf?src-supplier=Future+Electronics; ComponentLink1Description: https://datasheet.ciiva.com/17419/rc0805-17419909.pdf?src-supplier=Future+Electronics; Supplier 1: Digikey; Supplier Part Number 1: 311-1.00MCRCT-ND; Supplier 2: Mouser; Supplier Part Number 2: 603-RC0805FR-071ML
R9 = RC0805FR-07270KL: RES 270K OHM 1% 1/8W 0805; Manufacturer: Yageo; Voltage Rating: 150V; Power Rating: 125mW; Temperature Coefficient: 100ppm/°C; Supplier: Digikey; Supplier Part Number: 311-270KCRCT-ND; Manufacturer Part Number: RC0805FR-07270KL; RoHS: Yes; Category: Chip SMD Resistors; Stock: 171412; Pricing: 1=0,1, 10=0,025, 50=0,016, 100=0,0133, 500=0,00912, 1000=0,00787 (USD); Case/Package: 0805; Case Code (Metric): 2012; Case Code (Imperial): 0805; Min Operating Temperature: -55°C; Max Operating Temperature: 155°C; Packaging: Cut Tape; Termination: SMD/SMT; Package Quantity: 1; Series: RC; Voltage Rating (AC): 150V; Tolerance: 1%; Resistor Type: Thick Film; Number of Terminations: 2; Max Power Dissipation: 125mW; Working Voltage: 150V; Features: Moisture Resistant; Technology: THICK FILM; Resistance Tolerance: 1%; Length: 0.079inch; Width: 0.049inch; Height: 0.024inch; Depth: 1.25mm; Lead Free: Lead Free; RoHS Compliant: Yes; Reach SVHC Compliant: Unknown; ComponentLink1URL: https://datasheet.ciiva.com/11819/0900766b8106beab-11819833.pdf?src-supplier=Rs; ComponentLink1Description: https://datasheet.ciiva.com/11819/0900766b8106beab-11819833.pdf?src-supplier=Rs; ComponentLink2URL: https://datasheet.ciiva.com/2457/pyu-r-int-thick-7-2457227.pdf?src-supplier=Digikey; ComponentLink2Description: https://datasheet.ciiva.com/2457/pyu-r-int-thick-7-2457227.pdf?src-supplier=Digikey; ComponentLink3URL: https://datasheet.ciiva.com/2457/pyu-r-int-thick-7-2457228.pdf?src-supplier=Digikey; ComponentLink3Description: https://datasheet.ciiva.com/2457/pyu-r-int-thick-7-2457228.pdf?src-supplier=Digikey; ComponentLink4URL: https://datasheet.ciiva.com/2457/pyu-r-int-thick-7-2457229.pdf?src-supplier=Digikey; ComponentLink4Description: https://datasheet.ciiva.com/2457/pyu-r-int-thick-7-2457229.pdf?src-supplier=Digikey; ComponentLink5URL: https://datasheet.ciiva.com/5558/rc0805-5558095.pdf?src-supplier=Mouser; ComponentLink5Description: https://datasheet.ciiva.com/5558/rc0805-5558095.pdf?src-supplier=Mouser; Supplier 1: Digikey; Supplier Part Number 1: 311-270KCRCT-ND; Supplier 2: Mouser; Supplier Part Number 2: 603-RC0805FR-07270KL
R10 = RC0805FR-0710KL: RES 10K OHM 1% 1/8W 0805; Manufacturer: Yageo; Voltage Rating: 150V; Power Rating: 125mW; Temperature Coefficient: 100ppm/°C; Supplier: Digikey; Supplier Part Number: 311-10.0KCRCT-ND; Manufacturer Part Number: RC0805FR-0710KL; RoHS: Yes; Category: Chip SMD Resistors; Stock: 2107948; Pricing: 1=0,1, 10=0,027, 50=0,017, 100=0,0142, 500=0,00976, 1000=0,00844 (USD); Case/Package: 0805; Case Code (Imperial): 0805; Case Code (Metric): 2012; Min Operating Temperature: -55°C; Max Operating Temperature: 155°C; Packaging: Tape and Reel; Package Quantity: 1; Termination: SMD/SMT; Series: RC; Tolerance: 1%; Resistor Type: Thick Film; Number of Terminations: 2; Max Power Dissipation: 125mW; Features: Moisture Resistant; Construction: Rectangular; Resistance Tolerance: 1%; Technology: THICK FILM; Voltage Rating (AC): 150V; Length: 0.079inch; Width: 0.049inch; Height: 0.024inch; Depth: 1.25mm; RoHS Compliant: Yes; Reach SVHC Compliant: Unknown; Military Standard: Not; Lead Free: Lead Free; Supplier 1: Digikey; Supplier Part Number 1: 311-10.0KCRCT-ND; Supplier 2: Mouser; Supplier Part Number 2: 603-RC0805FR-0710KL; Supplier 3: Digikey; Supplier Part Number 3: 541-3976-1-ND
R11 = RC0805FR-0716KL: RES 16K OHM 1% 1/8W 0805; Manufacturer: Yageo; Power Rating: 125mW; Voltage Rating: 150V; Temperature Coefficient: 100ppm/°C; Supplier: Digikey; Supplier Part Number: 311-16.0KCRCT-ND; Manufacturer Part Number: RC0805FR-0716KL; RoHS: Yes; Category: Chip SMD Resistors; Stock: 164068; Pricing: 1=0,1, 10=0,026, 50=0,0162, 100=0,0136, 500=0,00932, 1000=0,00805 (USD); Case/Package: 0805; Case Code (Metric): 2012; Case Code (Imperial): 0805; Min Operating Temperature: -55°C; Max Operating Temperature: 155°C; Package Quantity: 1; Tolerance: 1%; Packaging: Tape and Reel; Number of Terminations: 2; Termination: SMD/SMT; Max Power Dissipation: 125mW; Voltage Rating (DC): 150V; Features: Moisture Resistant; Series: RC; Construction: Rectangular; Length: 0.079inch; Width: 0.049inch; Height: 0.024inch; Depth: 1.25mm; Military Standard: Not; Lead Free: Lead Free; RoHS Compliant: Yes; ComponentLink1URL: https://datasheet.ciiva.com/2457/pyu-r-int-thick-7-2457554.pdf?src-supplier=Digikey; ComponentLink1Description: https://datasheet.ciiva.com/2457/pyu-r-int-thick-7-2457554.pdf?src-supplier=Digikey; ComponentLink2URL: https://datasheet.ciiva.com/2457/pyu-r-int-thick-7-2457555.pdf?src-supplier=Digikey; ComponentLink2Description: https://datasheet.ciiva.com/2457/pyu-r-int-thick-7-2457555.pdf?src-supplier=Digikey; ComponentLink3URL: https://datasheet.ciiva.com/2457/pyu-r-int-thick-7-2457556.pdf?src-supplier=Digikey; ComponentLink3Description: https://datasheet.ciiva.com/2457/pyu-r-int-thick-7-2457556.pdf?src-supplier=Digikey; ComponentLink4URL: https://datasheet.ciiva.com/16744/rc0805-16744799.pdf?src-supplier=Future+Electronics; ComponentLink4Description: https://datasheet.ciiva.com/16744/rc0805-16744799.pdf?src-supplier=Future+Electronics; ComponentLink5URL: https://datasheet.ciiva.com/15189/getdatasheetpartid-327975-15189909.pdf?src-supplier=Verical; ComponentLink5Description: https://datasheet.ciiva.com/15189/getdatasheetpartid-327975-15189909.pdf?src-supplier=Verical; Supplier 1: Digikey; Supplier Part Number 1: 311-16.0KCRCT-ND; Supplier 2: Mouser; Supplier Part Number 2: 603-RC0805FR-0716KL
R12 = CRGCQ0805F100K: RES 100K OHM 1% 1/8W 0805; Manufacturer: TE Connectivity; Interface: I2C,SPI,IrDA,UART,USART; Peripherals: Brown-out Detect/Reset,POR,PWM,WDT,DMA; Memory Format: FLASH; Max Power Dissipation: 125mW; Temperature Coefficient: 100ppm/°C; Core Architecture: ARM; Number of I/Os: 47; Memory Size: 64KB; Oscillator Type: Internal; Voltage Rating: 150V; Supplier: Digikey; Supplier Part Number: A129773CT-ND; Manufacturer Part Number: CRGCQ0805F100K; RoHS: Yes; Category: Chip SMD Resistors; Stock: 241081; Pricing: 1=0,1, 10=0,033, 50=0,0212, 100=0,0177, 500=0,01228, 1000=0,01063 (USD); Case/Package: 0805; Case Code (Imperial): 0805; Case Code (Metric): 2012; Min Operating Temperature: -55°C; Max Operating Temperature: 85°C; Features: Moisture Resistant,Automotive AEC-Q200; Packaging: Cut Tape; Tolerance: 1%; Number of Terminations: 2; Series: CRGCQ; Power Rating: 125mW; Voltage Rating (DC): 150V; Operating Supply Voltage: 150V; Height: 650um; RoHS Compliant: Yes; ComponentLink1URL: https://www.te.com/commerce/DocumentDelivery/DDEController?Action=srchrtrv&DocNm=1773204-3&DocType=DS&DocLang=English&src-supplier=Digikey; ComponentLink1Description: https://www.te.com/commerce/DocumentDelivery/DDEController?Action=srchrtrv&DocNm=1773204-3&DocType=DS&DocLang=English&src-supplier=Digikey; ComponentLink2URL: https://www.te.com/commerce/DocumentDelivery/DDEController?Action=srchrtrv&amp;DocNm=1773204-3&amp;DocType=DS&amp;DocLang=English&src-supplier=Digikey; ComponentLink2Description: https://www.te.com/commerce/DocumentDelivery/DDEController?Action=srchrtrv&amp;DocNm=1773204-3&amp;DocType=DS&amp;DocLang=English&src-supplier=Digikey; ComponentLink3URL: https://4donline.ihs.com/images/VipMasterIC/IC/TYEL/TYEL-S-A0004929575/TYEL-S-A0004929575-1.pdf?hkey=52A5661711E402568146F3353EA87419&src-supplier=Farnell; ComponentLink3Description: https://4donline.ihs.com/images/VipMasterIC/IC/TYEL/TYEL-S-A0004929575/TYEL-S-A0004929575-1.pdf?hkey=52A5661711E402568146F3353EA87419&src-supplier=Farnell; ComponentLink4URL: https://datasheet.octopart.com/CRGCQ0805F100K-TE-Connectivity-datasheet-114679081.pdf?src-supplier=Master+Electronics; ComponentLink4Description: https://datasheet.octopart.com/CRGCQ0805F100K-TE-Connectivity-datasheet-114679081.pdf?src-supplier=Master+Electronics; Supplier 1: Mouser; Supplier Part Number 1: 279-CRGCQ0805F100K; Supplier 2: Digikey; Supplier Part Number 2: A129773CT-ND
R13 = RC0805FR-13330KL: RES 330K OHM 1% 1/8W 0805; Manufacturer: Yageo; Power Rating: 125mW; Voltage Rating: 150V; Temperature Coefficient: 100ppm/°C; Supplier: Digikey; Supplier Part Number: 13-RC0805FR-13330KLCT-ND; Manufacturer Part Number: RC0805FR-13330KL; RoHS: Yes; Category: Chip SMD Resistors; Stock: 27015; Pricing: 1=0,1, 10=0,025, 50=0,016, 100=0,0133, 500=0,00912, 1000=0,00787, 5000=0,00577, 10000=0,00511 (USD); Case/Package: 0805; Case Code (Imperial): 0805; Case Code (Metric): 2012; Contact Plating: Tin,Matte; Min Operating Temperature: -55°C; Max Operating Temperature: 155°C; Tolerance: 1%; Packaging: Tape and Reel; Termination: SMD/SMT; Series: RC; Length: 2mm; Width: 1.25mm; Height: 0.5mm; RoHS Compliant: Yes; ComponentLink1URL: http://www.mouser.com/ds/2/447/Yageo_08112016_RC0805-968729.pdf?src-supplier=Mouser; ComponentLink1Description: http://www.mouser.com/ds/2/447/Yageo_08112016_RC0805-968729.pdf?src-supplier=Mouser; ComponentLink2URL: http://www.yageo.com/documents/recent/PYu-RC_Group_51_RoHS_L_2.pdf?src-supplier=Avnet; ComponentLink2Description: http://www.yageo.com/documents/recent/PYu-RC_Group_51_RoHS_L_2.pdf?src-supplier=Avnet; ComponentLink3URL: https://datasheet.octopart.com/RC0805FR-13330KL-Yageo-datasheet-164759695.pdf?src-supplier=Future+Electronics; ComponentLink3Description: https://datasheet.octopart.com/RC0805FR-13330KL-Yageo-datasheet-164759695.pdf?src-supplier=Future+Electronics; Supplier 1: Digikey; Supplier Part Number 1: 13-RC0805FR-13330KLCT-ND; Supplier 2: Mouser; Supplier Part Number 2: 603-RC0805FR-13330KL
T3 = PJA3415_R1_00001: MOSFET P-CHANNEL 20V 4A SOT23; Manufacturer: Pan Jit; Manufacturer Part Number: PJA3415_R1_00001; RoHS: Yes; Stock 1: 8995; Pricing 1: 1=0,40000, 10=0,30100, 100=0,17040, 500=0,11286, 1000=0,08653 (USD); RoHS Compliant: Yes; JLCPCB Part: C391636; Supplier 1: Digikey; Supplier Part Number 1: 3757-PJA3415_R1_00001CT-ND; Supplier 2: Mouser; Supplier Part Number 2: 241-PJA3415_R1_00001
U3 = TLV7031QDBVRQ1: AUTOMOTIVE NANO POWER COMPARATOR; Manufacturer: Texas Instruments; Supplier 1: Digi-Key; Manufacturer Part Number: TLV7031QDBVRQ1; RoHS: No; Stock 1: 2000; Pricing 1: 1=0,96000, 10=0,86000, 25=0,81600, 100=0,67040, 250=0,62672, 500=0,55384, 1000=0,48125 (USD); RoHS Compliant: Yes; Supplier 2: Mouser; Supplier Part Number 2: 595-TLV7031QDBVRQ1; Supplier Part Number 1: 296-TLV7031QDBVRQ1CT-ND; JLCPCB Part: C3658921
U4 = LM4041DYM3-1.2-TR: IC VREF SHUNT 1% SOT23-3; Manufacturer: Microchip; Temperature Coefficient: 150ppm/°C; Cathode Current: 70uA; Output Type: Fixed; Output Current: 12mA; Min Output Voltage: 1.225V; Supplier 1: Digi-Key; Manufacturer Part Number: LM4041DYM3-1.2-TR; RoHS: Yes; Category: Voltage References; Stock 1: 2876; Pricing 1: 1=0,36000, 25=0,30760, 100=0,27560 (USD); Mount: Surface Mount; Case/Package: TO-236-3; Min Operating Temperature: -40°C; Max Operating Temperature: 85°C; Packaging: Tape and Reel; Tolerance: 1%; Reference Type: Shunt; ComponentLink1URL: https://datasheet.ciiva.com/16221/lm4040-16221709.pdf?src-supplier=Future+Electronics; ComponentLink1Description: https://datasheet.ciiva.com/16221/lm4040-16221709.pdf?src-supplier=Future+Electronics; Supplier 2: Mouser; Supplier Part Number 1: 576-2572-1-ND; Supplier Part Number 2: 998-LM4041DYM3-1.2TR; JLCPCB Part: *